# EAGLE design vendotron_v1 (EAGLE 7.5.0)
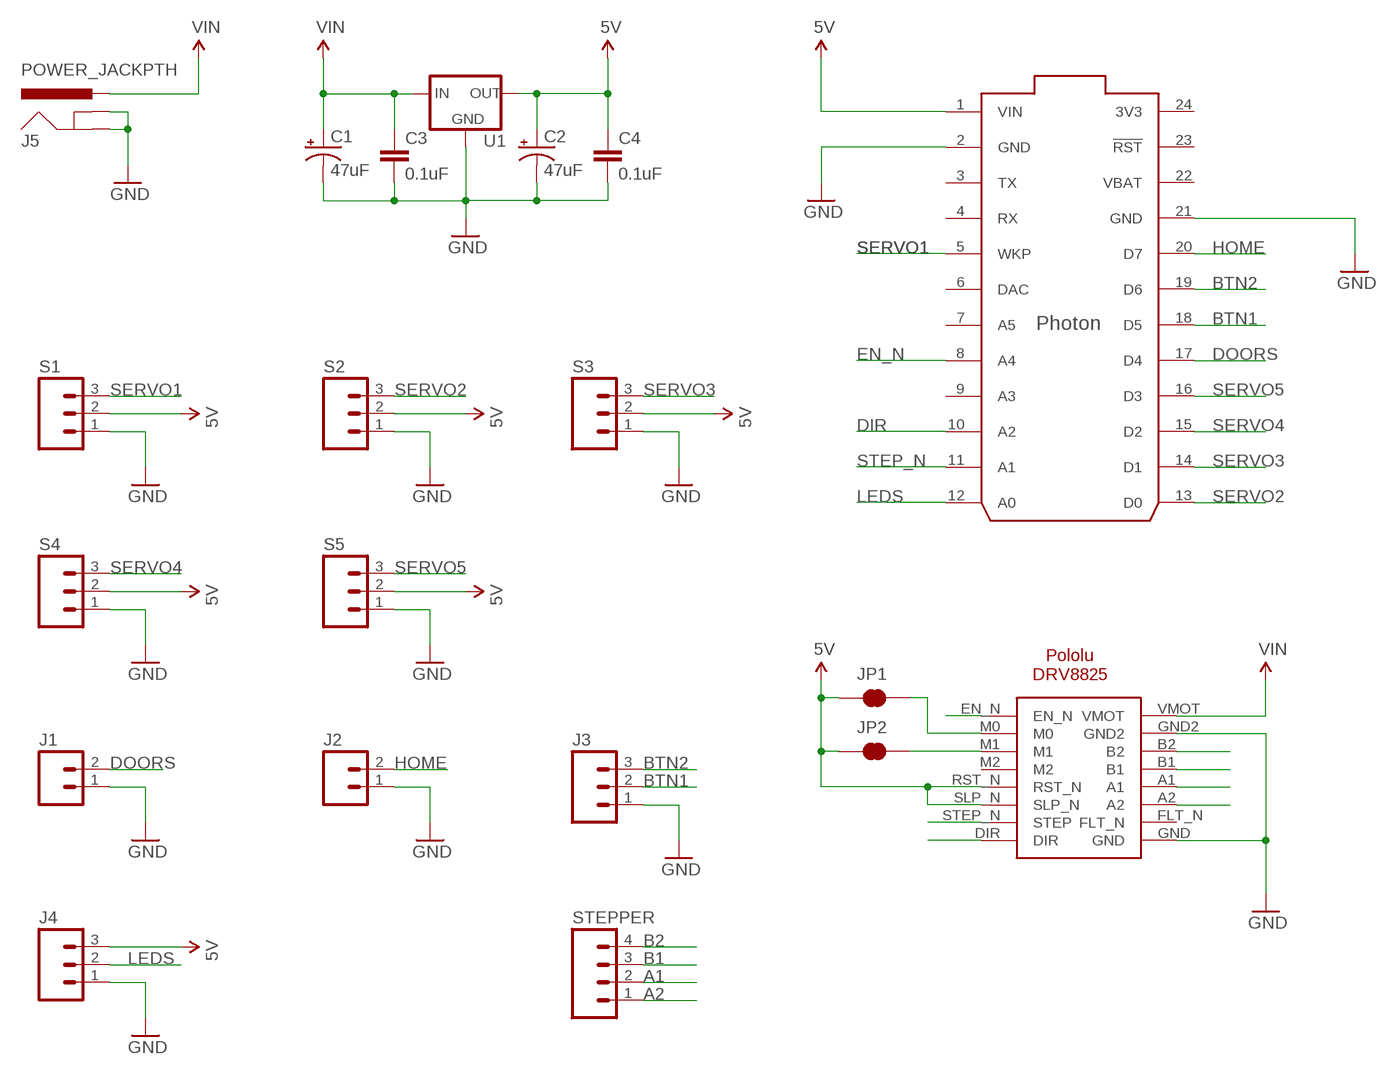
[diagram p0: schematic, sheet 1]

## Parts
C1  47uF  CAP_POLPTH2  [CPOL-RADIAL-10UF-25V]
C2  47uF  CAP_POLPTH2  [CPOL-RADIAL-10UF-25V]
C3  0.1uF  CAPPTH  [CAP-PTH-SMALL]
C4  0.1uF  CAPPTH  [CAP-PTH-SMALL]
J1  M023.5MM  [SCREWTERMINAL-3.5MM-2]
J2  M023.5MM  [SCREWTERMINAL-3.5MM-2]
J3  M03SCREW  [SCREWTERMINAL-3.5MM-3]
J4  M03SCREW  [SCREWTERMINAL-3.5MM-3]
J5  POWER_JACKPTH  [POWER_JACK_PTH]
JP1  JUMPER-PAD-2-NC_BY_TRACE  [PAD-JUMPER-2-NC_BY_TRACE_YES_SILK]
JP2  JUMPER-PAD-2-NC_BY_TRACE  [PAD-JUMPER-2-NC_BY_TRACE_YES_SILK]
S1  M03PTH  [1X03]
S2  M03PTH  [1X03]
S3  M03PTH  [1X03]
S4  M03PTH  [1X03]
S5  M03PTH  [1X03]
STEPPER  M04SCREW  [SCREWTERMINAL-3.5MM-4]
U1  V_REG_78XXSINK  [TO220-IGO]
U$1  PHOTON_WITH_HEADERS  [PHOTON]
U$2  POLOLU-DRV8825  [POLOLU-DRV8825]

## Nets
5V: C2.1(+) C4.1 J4.3 JP1.1 JP2.1 S1.2 S2.2 S3.2 S4.2 S5.2 U1.OUT U$1.1(VIN) U$2.RST_N U$2.SLP_N
A1: STEPPER.2 U$2.A1
A2: STEPPER.1 U$2.A2
B1: STEPPER.3 U$2.B1
B2: STEPPER.4 U$2.B2
BTN1: J3.2 U$1.18(D5)
BTN2: J3.3 U$1.19(D6)
DIR: U$1.10(A2) U$2.DIR
DOORS: J1.2 U$1.17(D4)
EN_N: U$1.8(A4) U$2.EN_N
GND: C1.2(-) C2.2(-) C3.2 C4.2 J1.1 J2.1 J3.1 J4.1 J5.GND J5.GNDBREAK S1.1 S2.1 S3.1 S4.1 S5.1 U1.GND U$1.2(GND) U$1.21(GND) U$2.GND U$2.GND2
HOME: J2.2 U$1.20(D7)
LEDS: J4.2 U$1.12(A0)
N$1: JP1.2 U$2.M0
N$2: JP2.2 U$2.M1
SERVO1: S1.3 U$1.5(WKP)
SERVO2: S2.3 U$1.13(D0)
SERVO3: S3.3 U$1.14(D1)
SERVO4: S4.3 U$1.15(D2)
SERVO5: S5.3 U$1.16(D3)
STEP_N: U$1.11(A1) U$2.STEP_N(STEP)
VIN: C1.1(+) C3.1 J5.PWR U1.IN U$2.VMOT
Unconnected: U$1.3(TX) U$1.4(RX) U$1.6(DAC) U$1.7(A5) U$1.9(A3) U$1.23(!RST) U$2.FLT_N U$2.M2

## Power pins joined to a net without a drawn wire
3V3: U$1.24(3V3)
VBAT: U$1.22(VBAT)

## Library data of the parts
C1 C2 = SparkFun-Passives:CAP_POL: Capacitor Polarized These are standard SMD and PTH capacitors. Normally 10uF, 47uF, and 100uF in electrolytic and tantalum varieties. Always verify the external diameter of the through hole cap, it varies with capacity, voltage, and manufacturer. The EIA devices should be standard.
C3 C4 = SparkFun-Passives:CAP: Capacitor Standard 0603 ceramic capacitor, and 0.1" leaded capacitor.
J1 J2 = SparkFun-Connectors:M02: Standard 2-pin 0.1" header. Use with - straight break away headers ( PRT-00116) - right angle break away headers (PRT-00553) - swiss pins (PRT-00743) - machine pins (PRT-00117) - female headers (PRT-00115) Molex polarized connector foot print use with: PRT-08233 with associated crimp pins and housings. 2.54_SCREWTERM for use with PRT-10571. 3.5mm Screw Terminal footprints for PRT-08084 5mm Screw Terminal footprints for use with PRT-08432; PROD_ID: CONN-08399
J3 J4 = SparkFun-Connectors:M03: Header 3 Standard 3-pin 0.1" header. Use with straight break away headers (SKU : PRT-00116), right angle break away headers (PRT-00553), swiss pins (PRT-00743), machine pins (PRT-00117), and female headers (PRT-00115). Molex polarized connector foot print use with SKU : PRT-08232 with associated crimp pins and housings.; PROD_ID: CONN-08288
J5 = SparkFun-Connectors:POWER_JACK: Power Jack This is the standard 5.5mm barrel jack for power. The PTH is the most common, proven, reliable, footprint. The Slot footprint only works if the mill layer is transmitted to the PCB fab house so be warned. Mating wall wart : TOL-00298 (and others); PROD_ID: CONN-08197
JP1 JP2 = SparkFun-Passives:JUMPER-PAD-2-NC_BY_TRACE
S1-S5 = SparkFun-Connectors:M03: Header 3 Standard 3-pin 0.1" header. Use with straight break away headers (SKU : PRT-00116), right angle break away headers (PRT-00553), swiss pins (PRT-00743), machine pins (PRT-00117), and female headers (PRT-00115). Molex polarized connector foot print use with SKU : PRT-08232 with associated crimp pins and housings.
STEPPER = SparkFun-Connectors:M04: Header 4 Standard 4-pin 0.1" header. Use with straight break away headers (SKU : PRT-00116), right angle break away headers (PRT-00553), swiss pins (PRT-00743), machine pins (PRT-00117), and female headers (PRT-00115). Molex polarized connector foot print use with SKU : PRT-08231 with associated crimp pins and housings. 1MM SMD Version SKU: PRT-10208; PROD_ID: Combine 2x8399
U1 = SparkFun-PowerIC:V_REG_78XX: Voltage Regulator Standard 78xx regulator. IGO (Input Ground Output). Spark Fun Electronics SKU : COM-00107
U$1 = Spark:PHOTON
U$2 = alvarop-lib:POLOLU-DRV8825

## Board
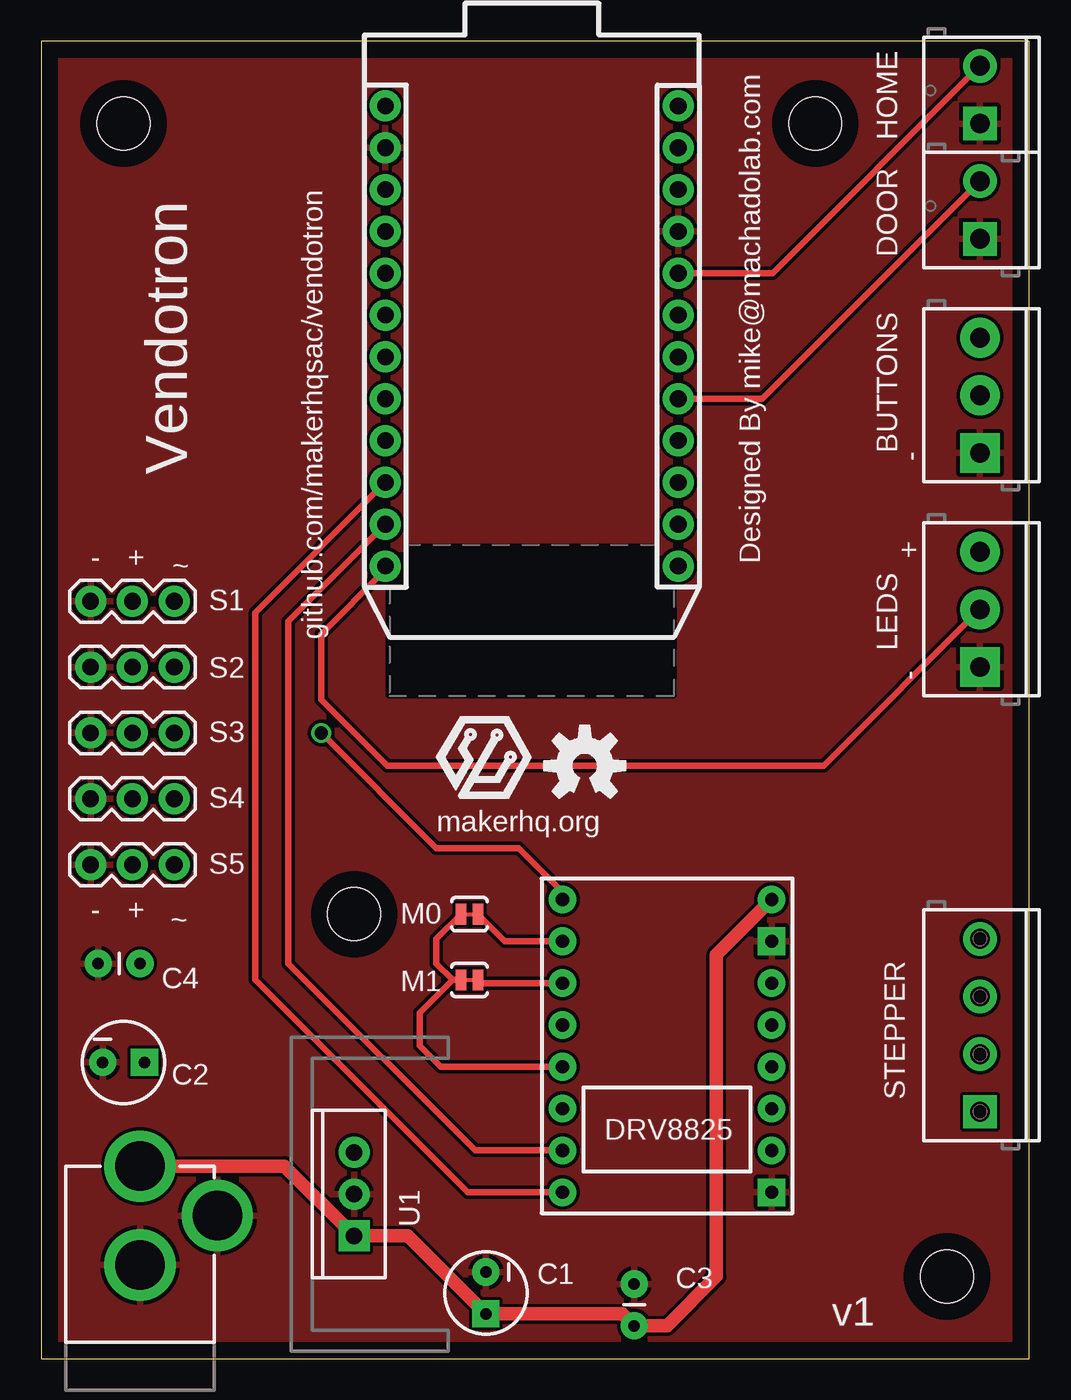
[diagram p1: board, top side]
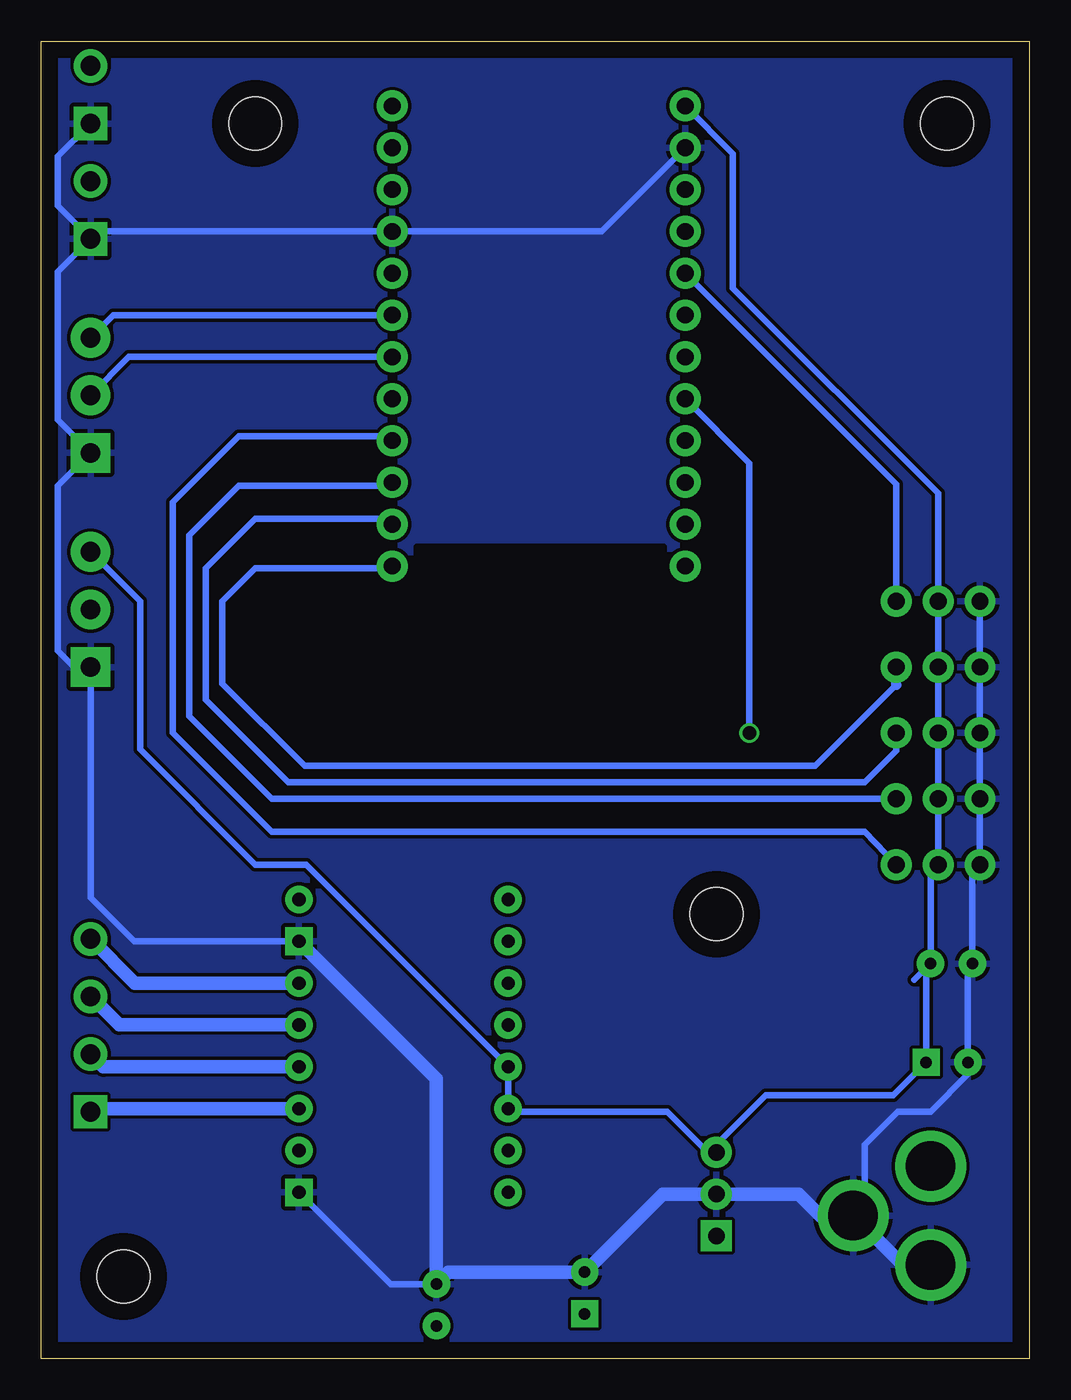
[diagram p2: board, bottom side, seen from below]

Size 60 x 80 mm. Coordinates in mm from the lower left corner, seen from the top.
Outline: 0,0 60,0 60,80 0,80 0,0
Copper layers (1*16): Top 0.035mm / dielectric 1.5mm / Bottom 0.035mm
Design rules "default": minimum track width 10mil, minimum drill 24mil, track to track 8mil, track to pad 8mil, pad to pad 8mil, via to via 8mil, smd to smd 8mil, copper to edge 40mil, drill to drill 8mil, minimum pad ring 10mil, minimum via ring 8mil, stop-mask expansion 4mil, vias tented up to drill 0mil, thermal gap 10mil
Holes 3.2 mm at 5,75 55,5 19,27 47,75
tRestrict: area 21.1,40.3 to 38.4,49.3
bRestrict: area 21.1,40.2 to 38.4,49.3

### Footprints (pad centres in the part's own frame; a part is rotated, then mirrored left to right if it is on the bottom)
CPOL-RADIAL-10UF-25V = drill 0.7 pad 1.651 square: 1 1.27,0 | drill 0.7 pad 1.651: 2 -1.27,0
CAP-PTH-SMALL = drill 0.7 pad 1.651: 1 0,0; 2 2.54,0
SCREWTERMINAL-3.5MM-2 = drill 1.2 pad 2.032 square: 1 0,0 | drill 1.2 pad 2.032: 2 3.5,0
SCREWTERMINAL-3.5MM-3 = drill 1.2 pad 2.413 square: 1 0,0 | drill 1.2 pad 2.413: 2 3.5,0; 3 7,0
POWER_JACK_PTH = drill 2.997 pad 4.318: GND 0,7.7; GNDBREAK 4.7,10.7; PWR 0,13.7
PAD-JUMPER-2-NC_BY_TRACE_YES_SILK = smd 0.635 x 1.27: 1 -0.508,0; 2 0.508,0
1X03 = drill 1.016 pad 1.88: 1 0,0; 2 2.54,0; 3 5.08,0
SCREWTERMINAL-3.5MM-4 = drill 1.2 pad 2.032 square: 1 0,0 | drill 1.2 pad 2.032: 2 3.5,0; 3 7,0; 4 10.5,0
TO220-IGO = drill 1 pad 1.88: GND 0,0; OUT 2.54,0 | drill 1 pad 1.88 square: IN -2.54,0
PHOTON = drill 1.016 pad 1.88: 1 1.27,32.258; 2 1.27,29.718; 3 1.27,27.178; 4 1.27,24.638; 5 1.27,22.098; 6 1.27,19.558; 7 1.27,17.018; 8 1.27,14.478; 9 1.27,11.938; 10 1.27,9.398; 11 1.27,6.858; 12 1.27,4.318; 13 19.05,4.318; 14 19.05,6.858; 15 19.05,9.398; 16 19.05,11.938; 17 19.05,14.478; 18 19.05,17.018; 19 19.05,19.558; 20 19.05,22.098; 21 19.05,24.638; 22 19.05,27.178; 23 19.05,29.718; 24 19.05,32.258
POLOLU-DRV8825 = drill 0.8 pad 1.676: A1 6.35,-1.27; A2 6.35,-3.81; B1 6.35,1.27; B2 6.35,3.81; DIR -6.35,-8.89; EN_N -6.35,8.89; FLT_N 6.35,-6.35; M0 -6.35,6.35; M1 -6.35,3.81; M2 -6.35,1.27; RST_N -6.35,-1.27; SLP_N -6.35,-3.81; STEP_N -6.35,-6.35; VMOT 6.35,8.89 | drill 0.8 pad 1.676 square: GND 6.35,-8.89; GND2 6.35,6.35

### Placement (x,y rotation side)
C1  27,4 270 top
C2  5,18 0 top
C3  36,2 90 top
C4  6,24 180 top
J1  57,68 90 top
J2  57,75 90 top
J3  57,55 90 top
J4  57,42 90 top
J5  6,-2 0 top
JP1  26,27 0 top
JP2  26,23 0 top
S1  3,46 0 top
S2  3,42 0 top
S3  3,38 0 top
S4  3,34 0 top
S5  3,30 0 top
STEPPER  57,15 90 top
U1  19,10 90 top
U$1  19.63,43.81 0 top
U$2  38,19 0 top
U$3  [MAKERHQ_LOGO_L]  24,34 0 top
U$4  [OSHW-LOGO-M]  33,36 0 top

### Tracks (layer width: path | path; a pad name or v marks a point on that pad's centre or on a via)
5V
  Top 0.406: U$2.RST_N 24.27,17.73 23,19 23,21 25,23 | JP2.1 25,23 | 25,23 24,24 24,25.51 JP1.1
  Bottom 0.406: U$2.RST_N U$2.SLP_N 31.46,15 22,15 19.54,12.54 U1.OUT 19,13 16,16 8.27,16 C2.1 6.27,23.73 C4.1 | U$2.RST_N 31.73,17.73 | U$1.1 18,73.17 18,65 5.54,52.54 S1.2 S2.2 S3.2 S4.2 S5.2 6,29.54 C4.1 | J4.3 54,46 54,37 47,30 43.92,30 U$2.RST_N | 7,23 C4.1
A1
  Bottom 0.813: U$2.A1 56.23,17.73 STEPPER.2
A2
  Bottom 0.813: U$2.A2 56.81,15.19 STEPPER.1
B1
  Bottom 0.813: U$2.B1 55.27,20.27 STEPPER.3
B2
  Bottom 0.813: U$2.B2 54.31,22.81 STEPPER.4
BTN1
  Bottom 0.406: U$1.18 54.67,60.83 J3.2
BTN2
  Bottom 0.406: U$1.19 55.63,63.37 J3.3
DIR
  Top 0.406: U$2.DIR 25.89,10.11 13,23 13,45.31 U$1.10
DOORS
  Top 0.406: U$1.17 43.79,58.29 J1.2
EN_N  (via drill 0.8)
  Top 0.406: U$2.EN_N 31.65,28.35 29,31 24,31 v17,38
  Bottom 0.406: v17,38 17,54.39 U$1.8
GND
  Bottom 0.406: S1.1 S2.1 S3.1 S4.1 S5.1 3.46,29.54 C4.2 3.73,23.73 C2.2 3.73,17.27 6,15 8,15 10,13 10,9.4 J5.GNDBREAK | U$1.2 25.98,68.45 U$1.21 56.55,68.45 J1.1 | U$2.GND2 54.35,25.35 57,28 J4.1 58,42 59,43 59,53 J3.1 59,57 59,66 J1.1 | J1.1 59,70 59,73 J2.1 | C3.2 38.78,4.54 U$2.GND
  Bottom 0.813: J5.GND 7.7,5.7 J5.GNDBREAK 12.7,8.7 14,10 U1.GND 22.27,10 C1.2 35.27,5.27 C3.2 36,17 U$2.GND2
  pour Top: 0,80 60,80 60,0 0,0
  pour Bottom: 0,80 60,80 60,0 0,0
HOME
  Top 0.406: U$1.20 44.41,65.91 J2.2
LEDS
  Top 0.406: U$1.12 20.9,47.9 17,44 17,40 21,36 47.5,36 J4.2
N$1
  Top 0.406: U$2.M0 28.16,25.35 JP1.2
N$2
  Top 0.406: U$2.M1 26.7,22.81 JP2.2
SERVO1
  Bottom 0.406: S1.3 8.08,53.09 U$1.5
SERVO2
  Bottom 0.406: 8.08,40.92 13,36 44,36 49,41 49,46 47,48 38.81,48 U$1.13
  Bottom 0.61: 8.08,40.92 S2.3
SERVO3
  Bottom 0.406: S3.3 8.08,36.92 10,35 45,35 50,40 50,48 47,51 39.01,51 U$1.14
SERVO4
  Bottom 0.406: S4.3 46,34 51,39 51,50 48,53 39.47,53 U$1.15
SERVO5
  Bottom 0.406: S5.3 10,32 46,32 52,38 52,52 48,56 38.93,56 U$1.16
STEP_N
  Top 0.406: U$2.STEP_N 26.35,12.65 15,24 15,44.77 U$1.11
VIN
  Top 0.813: U$2.VMOT 41,24.54 41,5 38,2 C3.1 35.27,2.73 C1.1 22.27,7.46 U1.IN 14.76,11.7 J5.PWR

### Text on the board
tPlace: Designed By mike@machadolab.com | HOME | DOOR | Vendotron | BUTTONS | - | - | + | ~ | + | github.com/makerhqsac/vendotron | LEDS | - | makerhq.org | - | + | ~ | M0 | M1 | U1 | v1